# Altium schematic sheet FPGA_bank13_14.SchDoc
size 420 x 297 mm
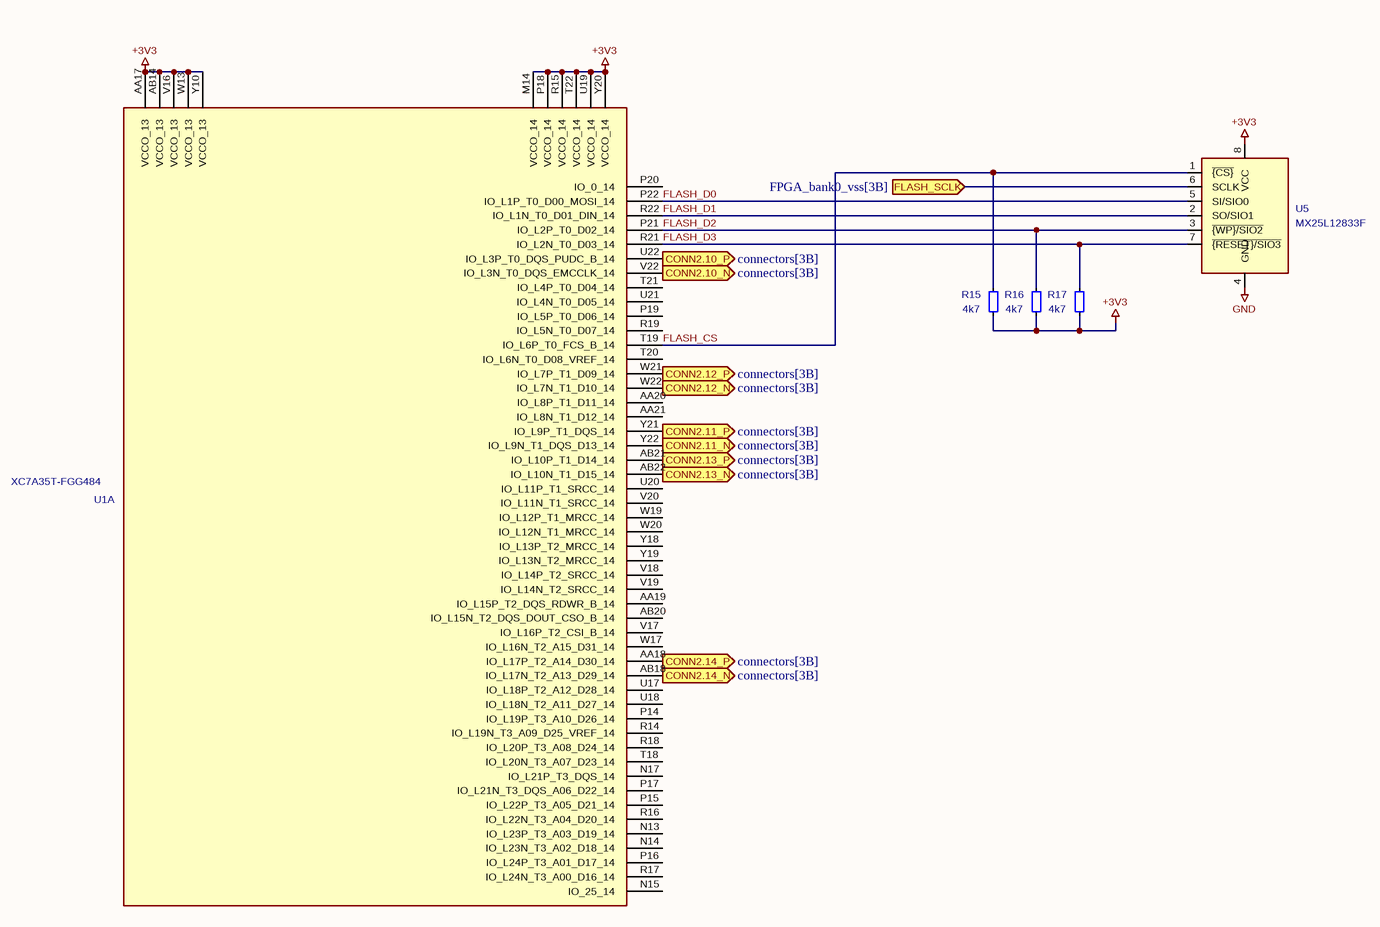
[diagram p0: FPGA_bank13_14.SchDoc]

## Parts
R15  4k7  [R_0402_1005Metric]
R16  4k7  [R_0402_1005Metric]
R17  4k7  [R_0402_1005Metric]
U1  value XC7A35T-FGG484  [FB-BGA-484_23.0x23.0mm_Layout22x22_P1.0mm]  (part A of 7)
U5  MX25L12833F  [WSON-8-1EP_6x5mm_P1.27mm_EP3.4x4mm]

## Ports
CONN2.10_N (in, see connectors[3B]), CONN2.10_P (in, see connectors[3B]), CONN2.11_N (in, see connectors[3B]), CONN2.11_P (in, see connectors[3B]), CONN2.12_N (in, see connectors[3B]), CONN2.12_P (in, see connectors[3B]), CONN2.13_N (in, see connectors[3B]), CONN2.13_P (in, see connectors[3B]), CONN2.14_N (in, see connectors[3B]), CONN2.14_P (in, see connectors[3B]), FLASH_SCLK (in, see FPGA_bank0_vss[3B])

## Nets
+3V3: R15.1 R16.1 R17.1 U1.AA17(VCCO_13) U1.AB14(VCCO_13) U1.M14(VCCO_14) U1.P18(VCCO_14) U1.R15(VCCO_14) U1.T22(VCCO_14) U1.U19(VCCO_14) U1.V16(VCCO_13) U1.W13(VCCO_13) U1.Y10(VCCO_13) U1.Y20(VCCO_14) U5.8(VCC)
GND: U5.4(GND)
CONN2.10_N: U1.V22(IO_L3N_T0_DQS_EMCCLK_14) ; port CONN2.10_N
CONN2.10_P: U1.U22(IO_L3P_T0_DQS_PUDC_B_14) ; port CONN2.10_P
CONN2.11_N: U1.Y22(IO_L9N_T1_DQS_D13_14) ; port CONN2.11_N
CONN2.11_P: U1.Y21(IO_L9P_T1_DQS_14) ; port CONN2.11_P
CONN2.12_N: U1.W22(IO_L7N_T1_D10_14) ; port CONN2.12_N
CONN2.12_P: U1.W21(IO_L7P_T1_D09_14) ; port CONN2.12_P
CONN2.13_N: U1.AB22(IO_L10N_T1_D15_14) ; port CONN2.13_N
CONN2.13_P: U1.AB21(IO_L10P_T1_D14_14) ; port CONN2.13_P
CONN2.14_N: U1.AB18(IO_L17N_T2_A13_D29_14) ; port CONN2.14_N
CONN2.14_P: U1.AA18(IO_L17P_T2_A14_D30_14) ; port CONN2.14_P
FLASH_CS: R15.2 U1.T19(IO_L6P_T0_FCS_B_14) U5.1(~{{CS}})
FLASH_D0: U1.P22(IO_L1P_T0_D00_MOSI_14) U5.5(SI/SIO0)
FLASH_D1: U1.R22(IO_L1N_T0_D01_DIN_14) U5.2(SO/SIO1)
FLASH_D2: R16.2 U1.P21(IO_L2P_T0_D02_14) U5.3(~{{WP}/SIO2})
FLASH_D3: R17.2 U1.R21(IO_L2N_T0_D03_14) U5.7(~{{RESET}/SIO3})
FLASH_SCLK: U5.6(SCLK) ; port FLASH_SCLK

Not connected (* = marked no-connect by the designer): U1 AA19(IO_L15P_T2_DQS_RDWR_B_14) AA20(IO_L8P_T1_D11_14) AA21(IO_L8N_T1_D12_14) AB20(IO_L15N_T2_DQS_DOUT_CSO_B_14) N13(IO_L23P_T3_A03_D19_14) N14(IO_L23N_T3_A02_D18_14) N15(IO_25_14) N17(IO_L21P_T3_DQS_14) P14(IO_L19P_T3_A10_D26_14) P15(IO_L22P_T3_A05_D21_14) P16(IO_L24P_T3_A01_D17_14) P17(IO_L21N_T3_DQS_A06_D22_14) P19(IO_L5P_T0_D06_14) P20(IO_0_14) R14(IO_L19N_T3_A09_D25_VREF_14) R16(IO_L22N_T3_A04_D20_14) R17(IO_L24N_T3_A00_D16_14) R18(IO_L20P_T3_A08_D24_14) R19(IO_L5N_T0_D07_14) T18(IO_L20N_T3_A07_D23_14) T20(IO_L6N_T0_D08_VREF_14) T21(IO_L4P_T0_D04_14) U17(IO_L18P_T2_A12_D28_14) U18(IO_L18N_T2_A11_D27_14) U20(IO_L11P_T1_SRCC_14) U21(IO_L4N_T0_D05_14) V17(IO_L16P_T2_CSI_B_14) V18(IO_L14P_T2_SRCC_14) V19(IO_L14N_T2_SRCC_14) V20(IO_L11N_T1_SRCC_14) W17(IO_L16N_T2_A15_D31_14) W19(IO_L12P_T1_MRCC_14) W20(IO_L12N_T1_MRCC_14) Y18(IO_L13P_T2_MRCC_14) Y19(IO_L13N_T2_MRCC_14)

## Notes on the sheet
- 1
- 2
- 3
- 4
- 5
- 6
- 7
- 8
- A
- B
- C
- D
- E
- Title:
- File: FPGA_bank13_14.kicad_sch
- Sheet: /
- F
- KiCad E.D.A.  kicad (5.1.4)-1
- Size: A3
- Date:
- Rev:
- Id: 1/1

## Library data of the parts
R15-R17 = R_Small: JLCPCB: C3017492; Value: 4k7; Footprint: Resistor_SMD:R_0402_1005Metric
U1 = XC7A35T-FGG484: Footprint: Package_BGA:FB-BGA-484_23.0x23.0mm_Layout22x22_P1.0mm
U5 = MX25R3235FM2xx0: JLCPCB: C2802709; Value: MX25L12833F; Footprint: Package_SON:WSON-8-1EP_6x5mm_P1.27mm_EP3.4x4mm